# Altium schematic sheet 06.MicroSD Card.SchDoc: CM3 IO
size 297 x 209 mm; Page Create Date: March  8, 1995; Page Number: 06; Page Size: A4; Comment: radxa_1010; Page Count: 20; RevCode: 1.36; Doc: MicroSD Card; DsnPath: D:\WMS\黄工\[RC119]CM3_IO_V1.36\对外资料\radxa_cm3_io_board_v1360.DSN; SchematicName: CM3_IO V1.36; PageName: 06.MicroSD Card; PageSize: A4; TopSchematic: True
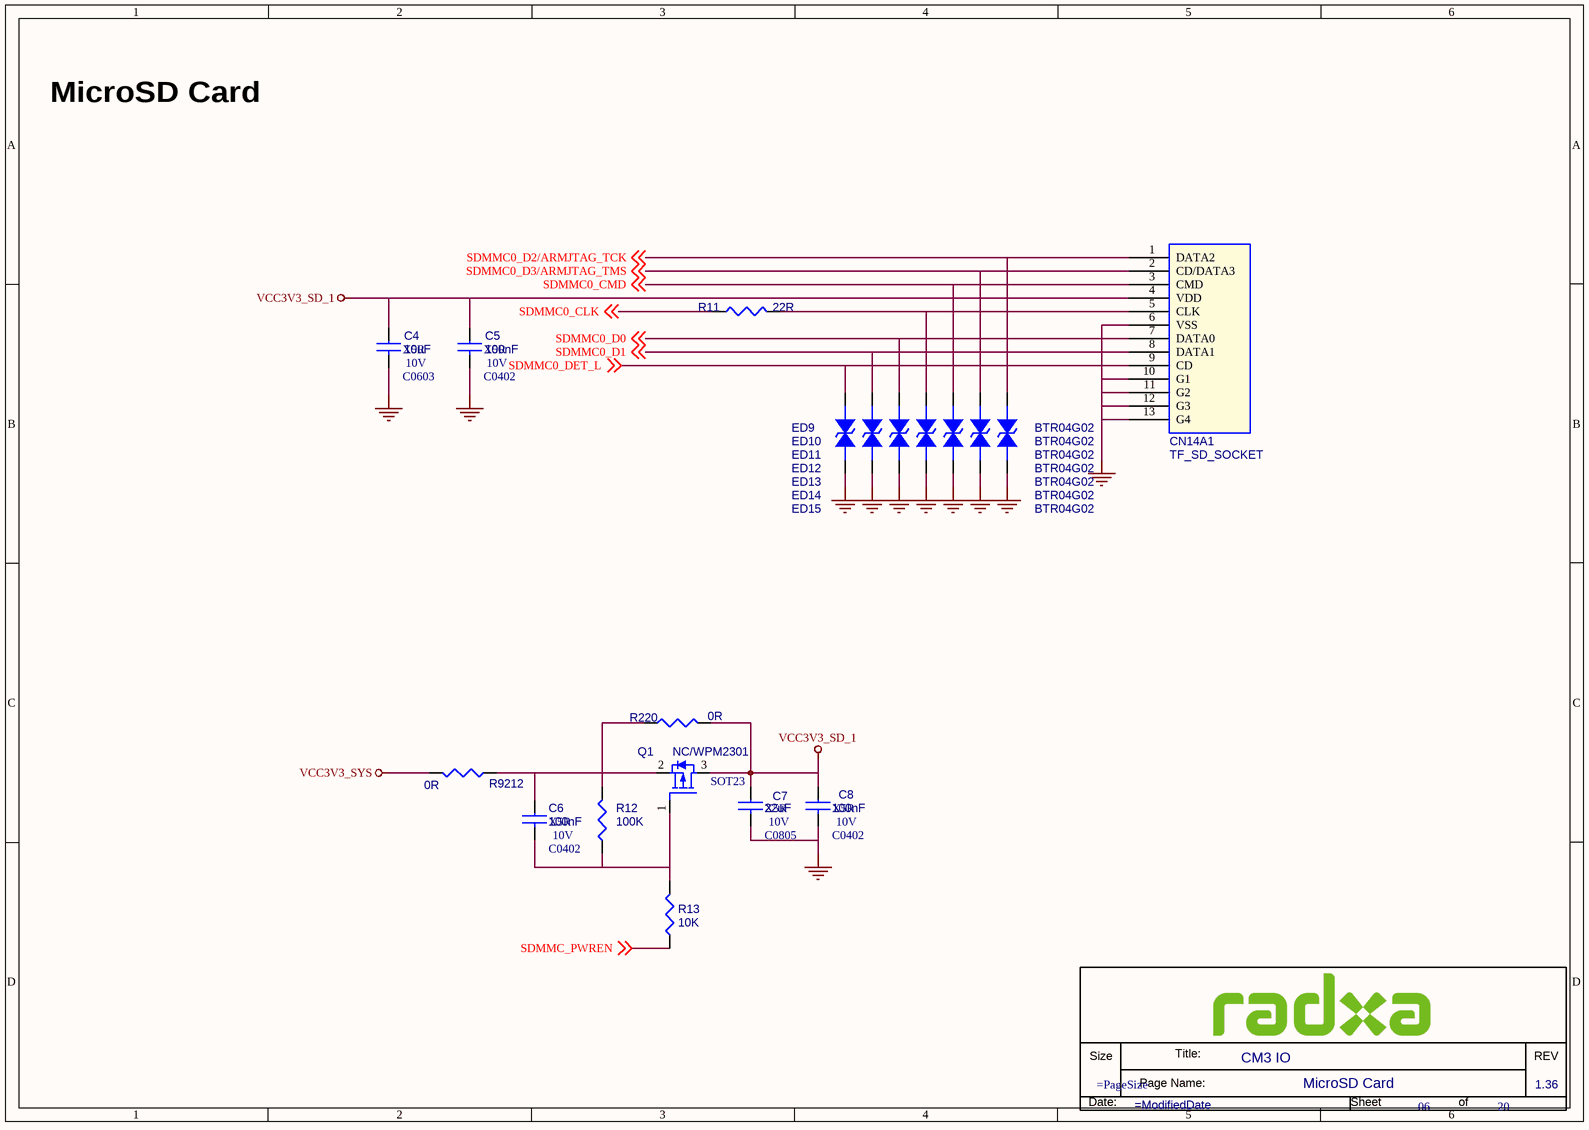
[diagram p0: 06.MicroSD Card.SchDoc]

## Parts
*  Doc: MicroSD Card  RevCode: 1.36  Title: CM3 IO  Page Number: 06  Page Count: 20  (hidden comment: radxa_1010)  (graphical)
C4  10uF  Voltage: 10V  Dielectric: X5R  [C0603]
C5  100nF  Voltage: 10V  Dielectric: X5R  [C0402]
C6  100nF  Voltage: 10V  Dielectric: X5R  [C0402]
C7  22uF  Voltage: 10V  Dielectric: X5R  [C0805]
C8  100nF  Voltage: 10V  Dielectric: X5R  [C0402]
CN14A1  TF_SD_SOCKET  [TF-CKT01-009D]
ED9  BTR04G02  [ESD0402_1xD5]
ED10  BTR04G02  [ESD0402_1xD5]
ED11  BTR04G02  [ESD0402_1xD5]
ED12  BTR04G02  [ESD0402_1xD5]
ED13  BTR04G02  [ESD0402_1xD5]
ED14  BTR04G02  [ESD0402_1xD5]
ED15  BTR04G02  [ESD0402_1xD5]
Q1  NC/WPM2301  [SOT23]
R11  22R  [R0402]
R12  100K  [R0402]
R13  10K  [R0402]
R220  0R  [R0402]
R9212  0R  [R0603]

## Nets
GND: C4.2 C5.2 C7.2 C8.2 CN14A1.6(VSS) CN14A1.10(G1) CN14A1.11(G2) CN14A1.12(G3) CN14A1.13(G4) ED9.2 ED10.2 ED11.2 ED12.2 ED13.2 ED14.2 ED15.2
VCC3V3_SD_1: C4.1 C5.1 C7.1 C8.1 CN14A1.4(VDD) Q1.3(DRAIN) R220.2
VCC3V3_SYS: R9212.2
SDMMC0_CLK: R11.1 ; off-sheet SDMMC0_CLK
SDMMC0_CMD: CN14A1.3(CMD) ED13.1 ; off-sheet SDMMC0_CMD
SDMMC0_D0: CN14A1.7(DATA0) ED11.1 ; off-sheet SDMMC0_D0
SDMMC0_D1: CN14A1.8(DATA1) ED10.1 ; off-sheet SDMMC0_D1
SDMMC0_D2/ARMJTAG_TCK: CN14A1.1(DATA2) ED15.1 ; off-sheet SDMMC0_D2/ARMJTAG_TCK
SDMMC0_D3/ARMJTAG_TMS: CN14A1.2(CD/DATA3) ED14.1 ; off-sheet SDMMC0_D3/ARMJTAG_TMS
SDMMC0_DET_L: CN14A1.9(CD) ED9.1 ; off-sheet SDMMC0_DET_L
SDMMC_PWREN: R13.2 ; off-sheet SDMMC_PWREN
NetC6_1: C6.1 Q1.2(SOURCE) R12.1 R220.1 R9212.1
NetC6_2: C6.2 Q1.1(GATE) R12.2 R13.1
NetCN14A1_5: CN14A1.5(CLK) ED12.1 R11.2

## Notes on the sheet
- MicroSD Card
- (in symbol radxa_1010) Title:; Size; REV; Page Name:; Date:; Sheet; of

## Library data of the parts
C4 = CAP NP_0: cap,10.00uF,+/-10%,10V,X5R,C0603; Part Reference: C4; Manufacturer: TDK; RK PN: C1608X5R1A106K080AC; Priority: A; C_Voltage: 6.3V; Tolerance: 10%; PCB Footprint: C0603; Value: 10uF; Part Type: C0603; Manufacturer PN: C1608X5R1A106K080AC; Created by: JJJ
C5 = CAP NP_0: cap,100.00nF,+/-10%,10V,X5R,C0402; Part Reference: C5; Manufacturer: TDK; RK PN: C1005X5R1A104K050BA; Priority: A; Tolerance: 10%; C_Voltage: 6.3V; PCB Footprint: C0402; Value: 100nF; Part Type: C0402; Manufacturer PN: C1005X5R1A104K050BA; Created by: JJJ
C6 = CAP NP_0: cap,100.00nF,+/-10%,16V,X5R,C0402; Part Reference: C6; Manufacturer: TDK; RK PN: C1005X5R1C104K050BA; Priority: A; Tolerance: 10%; PCB Footprint: C0402; Value: 100nF; Part Type: C0402; Manufacturer PN: C1005X5R1C104K050BA; Created by: JJJ
C7 = CAP NP_0: cap,10.00uF,+/-10%,6.3V,X5R,C0603; Part Reference: C7; Manufacturer PN: C1608X5R0J106K080AB; Manufacturer: TDK; Tolerance: 10%; Priority: A; PCB Footprint: C0805; Value: 22uF; Created by: JJJ; Part Type: C0603; RK PN: C1608X5R0J106K080AB
C8 = CAP NP_0: cap,100.00nF,+/-10%,16V,X5R,C0402; Part Reference: C8; Manufacturer PN: C1005X5R1C104K050BA; Manufacturer: TDK; Tolerance: 10%; Priority: A; PCB Footprint: C0402; Value: 100nF; Created by: JJJ; Part Type: C0402; RK PN: C1005X5R1C104K050BA
CN14A1 = SD_SOCKET_0: Part Reference: CN14A1; Value: TF_SD_SOCKET; PCB Footprint: TF-CKT01-009D
ED9 = DIODE BI-DIR TRIG: ESD; Part Reference: ED9; Value: BTR04G02; PCB Footprint: ESD0402_1xD5
ED10 = DIODE BI-DIR TRIG: ESD; Part Reference: ED10; Value: BTR04G02; PCB Footprint: ESD0402_1xD5
ED11 = DIODE BI-DIR TRIG: ESD; Part Reference: ED11; Value: BTR04G02; PCB Footprint: ESD0402_1xD5
ED12 = DIODE BI-DIR TRIG: ESD; Part Reference: ED12; Value: BTR04G02; PCB Footprint: ESD0402_1xD5
ED13 = DIODE BI-DIR TRIG: ESD; Part Reference: ED13; Value: BTR04G02; PCB Footprint: ESD0402_1xD5
ED14 = DIODE BI-DIR TRIG: ESD; Part Reference: ED14; Value: BTR04G02; PCB Footprint: ESD0402_1xD5
ED15 = DIODE BI-DIR TRIG: ESD; Part Reference: ED15; Value: BTR04G02; PCB Footprint: ESD0402_1xD5
Q1 = MOSFET P: PMOS,WPM3407-3/TR,SOT_23,Id=4.4A,Vds=30V; Part Reference: Q1; Manufacturer: WillSemi(韦尔半导体); Priority: A; Id_max: 4.4A; Vgs: ±20V; VDS: 30V; Vgsth: 2.0V; Pd: 0.9W; PCB Footprint: SOT23; Value: NC/WPM2301; RK PN: WPM3407-3/TR; Part Type: PMOS; Manufacturer PN: WPM3407-3/TR; Created by: JJJ
R11 = RESISTOR_1: Part Reference: R11; Value: 22R; PCB Footprint: R0402
R12 = RESISTOR_0: 通用厚膜电阻,100K,+/-5%,R0402,1/16W.; Part Reference: R12; Manufacturer: YAGEO; RK PN: RC0402JR-07100KL; Priority: A; Tolerance: 5%; Wattage: 1/16W; Value: 100K; Part Type: 通用厚膜电阻; Manufacturer PN: RC0402JR-07100KL; Created by: YTL; PCB Footprint: R0402
R13 = RESISTOR_0: 通用厚膜电阻,10K,+/-5%,R0402,1/16W.; Part Reference: R13; Manufacturer PN: RC0402JR-0710KL; Manufacturer: YAGEO; Wattage: 1/16W; Tolerance: 5%; Priority: A; Value: 10K; Created by: YTL; Part Type: 通用厚膜电阻; RK PN: RC0402JR-0710KL; PCB Footprint: R0402
R220 = RESISTOR_0: 通用厚膜电阻,0R,+/-5%,R0402,1/16W.; Part Reference: R220; Manufacturer: YAGEO; RK PN: RC0402JR-070RL; Priority: A; Tolerance: 5%; Wattage: 1/16W; Value: 0R; Part Type: 通用厚膜电阻; Manufacturer PN: RC0402JR-070RL; Created by: YTL; PCB Footprint: R0402
R9212 = RESISTOR_0: 通用厚膜电阻,100R,+/-5%,R0402,1/16W.; Part Reference: R9212; Manufacturer: YAGEO; RK PN: RC0402JR-07100RL; Priority: A; Tolerance: 5%; Wattage: 1/16W; Value: 0R; Part Type: 通用厚膜电阻; Manufacturer PN: RC0402JR-07100RL; Created by: YTL; PCB Footprint: R0603
* = radxa_1010: Page Create Date: March  8, 1995; Page Size: =PageSize; Page Modify Date: =ModifiedDate